# Altium schematic sheet LatchingFaultActiveHigh.SchDoc
size A; Author: Nicholas Velcea; Revision: 1; SheetNumber: 1
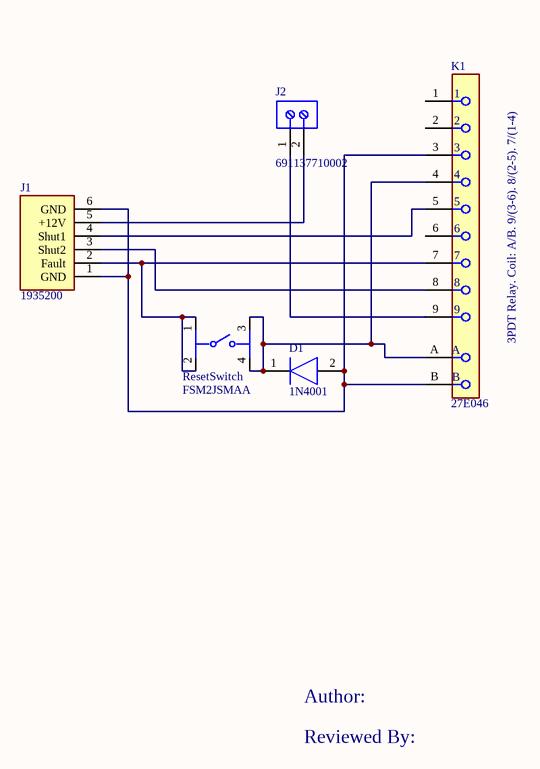
[diagram p0: LatchingFaultActiveHigh.SchDoc]

## Parts
D1  1N4001  [DIOAD1410W86L470D235]
J1  1935200  [1935200]
J2  691137710002  [691137710002]
K1  27E046  [FP-27E046-MFG]
ResetSwitch  FSM2JSMAA  [FP-FSM2JSMAA-MFG]

## Nets
NetD1_1: D1.1(K) K1.4 K1.A ResetSwitch.3 ResetSwitch.4
NetD1_2: D1.2(A) J1.1(GND) J1.6(GND) K1.3 K1.B
NetJ1_2: J1.2(Fault) K1.7 ResetSwitch.1 ResetSwitch.2
NetJ1_3: J1.3(Shut2) K1.8
NetJ1_4: J1.4(Shut1) K1.5
NetJ1_5: J1.5(+12V) J2.2
NetJ2_1: J2.1 K1.9

Not connected (* = marked no-connect by the designer): K1 1 2 6

## Notes on the sheet
- 3PDT Relay. Coil: A/B. 9/(3-6). 8/(2-5). 7/(1-4)
- Author:
- Reviewed By:

## Library data of the parts
D1 = 1N4001: Diode; Manufacturer_Name: MULTICOMP; Datasheet Link: http://www.farnell.com/datasheets/58590.pdf; Manufacturer_Part_Number: 1N4001
J1 = 1935200: Connector; Manufacturer_Name: Phoenix Contact; Allied_Number: 70054959; Datasheet Link: https://www.phoenixcontact.com/online/portal/us?uri=pxc-oc-itemdetail:pid=1935200&library=usen&tab=1; Height: 11.55mm; Manufacturer_Part_Number: 1935200; Mouser Part Number: 651-1935200; Mouser Price/Stock: https://www.mouser.com/Search/Refine.aspx?Keyword=651-1935200; RS Part Number: 8045509; RS Price/Stock: http://uk.rs-online.com/web/p/products/8045509; Allied Price/Stock: https://www.alliedelec.com/phoenixcontact-1935200/70054959/
J2 = CMP-1502-03324-1: Series 1377 - 5.00 mm Horizontal Entry with Pressure Clamp WR-TBL, 2 pin; Manufacturer: Wurth Elektronik; Pin Number: 2; Pitch: 5.00mm; Operating Temperature: -30to120degC; Package Reference: 691137710002; Publisher: WurthElektronik; Mounting Technology: THT; Manufacturer URL: http://www.we-online.de; Packaging: Box; Part Number: 691137710002; Datasheet URL: http://katalog.we-online.de/pbs/datasheet/691137710002.pdf
K1 = CMP-03370-000002-1: RELAY SOCKET 11 POS THROUGH HOLE; Manufacturer: TE Connectivity; Conn Orientation: Vertical; Current Rating: 15A; Is Female: yes; Number Of Contacts: 11; Conn Gender: Female; Device Class L1: Connectors; Octopart: https://octopart.com/27e046-te+connectivity-39661310; Device Class L2: IC and Component Sockets; ComponentLink2Description: Datasheet; Manufacturer Part Number: 27E046; Height: 13.89mm; Lead Free: Yes; Number Of Rows: 4; ComponentLink2URL: https://www.te.com/commerce/DocumentDelivery/DDEController?Action=srchrtrv&DocNm=1308242_KUKUP&DocType=DS&DocLang=English; Category: Conn; Mouser Description: Relay Accessories Nylon Relay Socket for Electromechanical Relay; Contact Material: Tin; Package: 27E046; Automotive: No; Digikey Description: RELAY SOCKET 11 POS THROUGH HOLE; RoHS: TRUE; Device Class L3: unset
ResetSwitch = CMP-03402-000003-1: SWITCH TACTILE SPST-NO 0.05A 24V; Manufacturer: TE Connectivity; Standoff Height: 0.05mm; Contact Current Rating: 50mA; Electromechanical Life: 100000Cycles; Operating Force: 260gf; Contact Resistance: 100mΩ; Package: 0; Temperature Range High: +85°C; Temperature: -35°C to +85°C; Category: Switch; Manufacturer Part Number: FSM2JSMAA; RoHS: TRUE; Mouser Description: Tactile Switches TACTILE 260G FORCE S; Device Class L1: Electromechanical; Mount: Surface Mount; Height: 4.59mm; ComponentLink2URL: https://www.te.com/commerce/DocumentDelivery/DDEController?Action=showdoc&DocId=Customer+Drawing%7F2-1437565-7%7FV%7Fpdf%7FEnglish%7FENG_CD_2-1437565-7_V.pdf%7F2-1437565-8; Temperature Range Low: -35°C; Voltage Rating Dc: 24V; Lead Free: Yes; Automotive: No; Throw Configuration: SPST-NO; Octopart: https://octopart.com/fsm2jsmaa-te+connectivity-41720620; Device Class L2: Switches; Device Class L3: Pushbutton Switches; ComponentLink2Description: Datasheet; Digikey Description: SWITCH TACTILE SPST-NO 0.05A 24V